# Altium project My_STM32_BOARD.PrjPcb
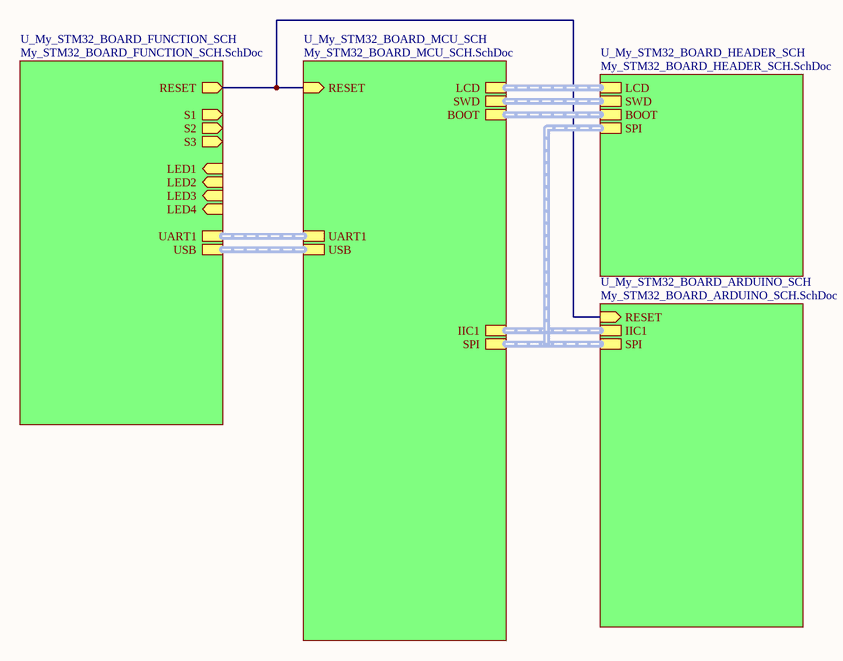
[diagram p0: My_STM32_BOARDSCH.SchDoc]
5 sheets, 69 parts. Net scope: hierarchical (ports join the sheet entries above them; power ports are global).
Board file: My_STM32_BOARD_PCB.PcbDoc
Sheets:
  My_STM32_BOARDSCH.SchDoc
    U_My_STM32_BOARD_FUNCTION_SCH = My_STM32_BOARD_FUNCTION_SCH.SchDoc
    U_My_STM32_BOARD_MCU_SCH = My_STM32_BOARD_MCU_SCH.SchDoc
    U_My_STM32_BOARD_HEADER_SCH = My_STM32_BOARD_HEADER_SCH.SchDoc
    U_My_STM32_BOARD_ARDUINO_SCH = My_STM32_BOARD_ARDUINO_SCH.SchDoc

## Sheet My_STM32_BOARDSCH.SchDoc
size A4

### Sub-sheets
U_My_STM32_BOARD_ARDUINO_SCH = My_STM32_BOARD_ARDUINO_SCH.SchDoc: IIC1 (harness IIC1), SPI (harness SPI), RESET (in)
U_My_STM32_BOARD_FUNCTION_SCH = My_STM32_BOARD_FUNCTION_SCH.SchDoc: LED1 (in), LED2 (in), LED3 (in), LED4 (in), S1 (out), S2 (out), S3 (out), RESET (out), UART1 (harness UART1), USB (harness USB)
U_My_STM32_BOARD_HEADER_SCH = My_STM32_BOARD_HEADER_SCH.SchDoc: LCD (harness FSMC), SWD (harness SWD), BOOT (harness BOOT), SPI (harness SPI)
U_My_STM32_BOARD_MCU_SCH = My_STM32_BOARD_MCU_SCH.SchDoc: RESET (in), USB (harness USB), UART1 (harness UART1), LCD (harness FSMC), SWD (harness SWD), SPI (harness SPI), IIC1 (harness IIC1), BOOT (harness BOOT)

### Nets
RESET: sheet U_My_STM32_BOARD_FUNCTION_SCH/RESET, sheet U_My_STM32_BOARD_MCU_SCH/RESET, sheet U_My_STM32_BOARD_ARDUINO_SCH/RESET

### Buses and harness runs
harness sheet U_My_STM32_BOARD_ARDUINO_SCH/IIC1 = sheet U_My_STM32_BOARD_MCU_SCH/IIC1
harness sheet U_My_STM32_BOARD_ARDUINO_SCH/SPI = sheet U_My_STM32_BOARD_HEADER_SCH/SPI = sheet U_My_STM32_BOARD_MCU_SCH/SPI
harness sheet U_My_STM32_BOARD_FUNCTION_SCH/UART1 = sheet U_My_STM32_BOARD_MCU_SCH/UART1
harness sheet U_My_STM32_BOARD_FUNCTION_SCH/USB = sheet U_My_STM32_BOARD_MCU_SCH/USB
harness sheet U_My_STM32_BOARD_HEADER_SCH/BOOT = sheet U_My_STM32_BOARD_MCU_SCH/BOOT
harness sheet U_My_STM32_BOARD_HEADER_SCH/LCD = sheet U_My_STM32_BOARD_MCU_SCH/LCD
harness sheet U_My_STM32_BOARD_HEADER_SCH/SWD = sheet U_My_STM32_BOARD_MCU_SCH/SWD

## Sheet My_STM32_BOARD_FUNCTION_SCH.SchDoc
size A4
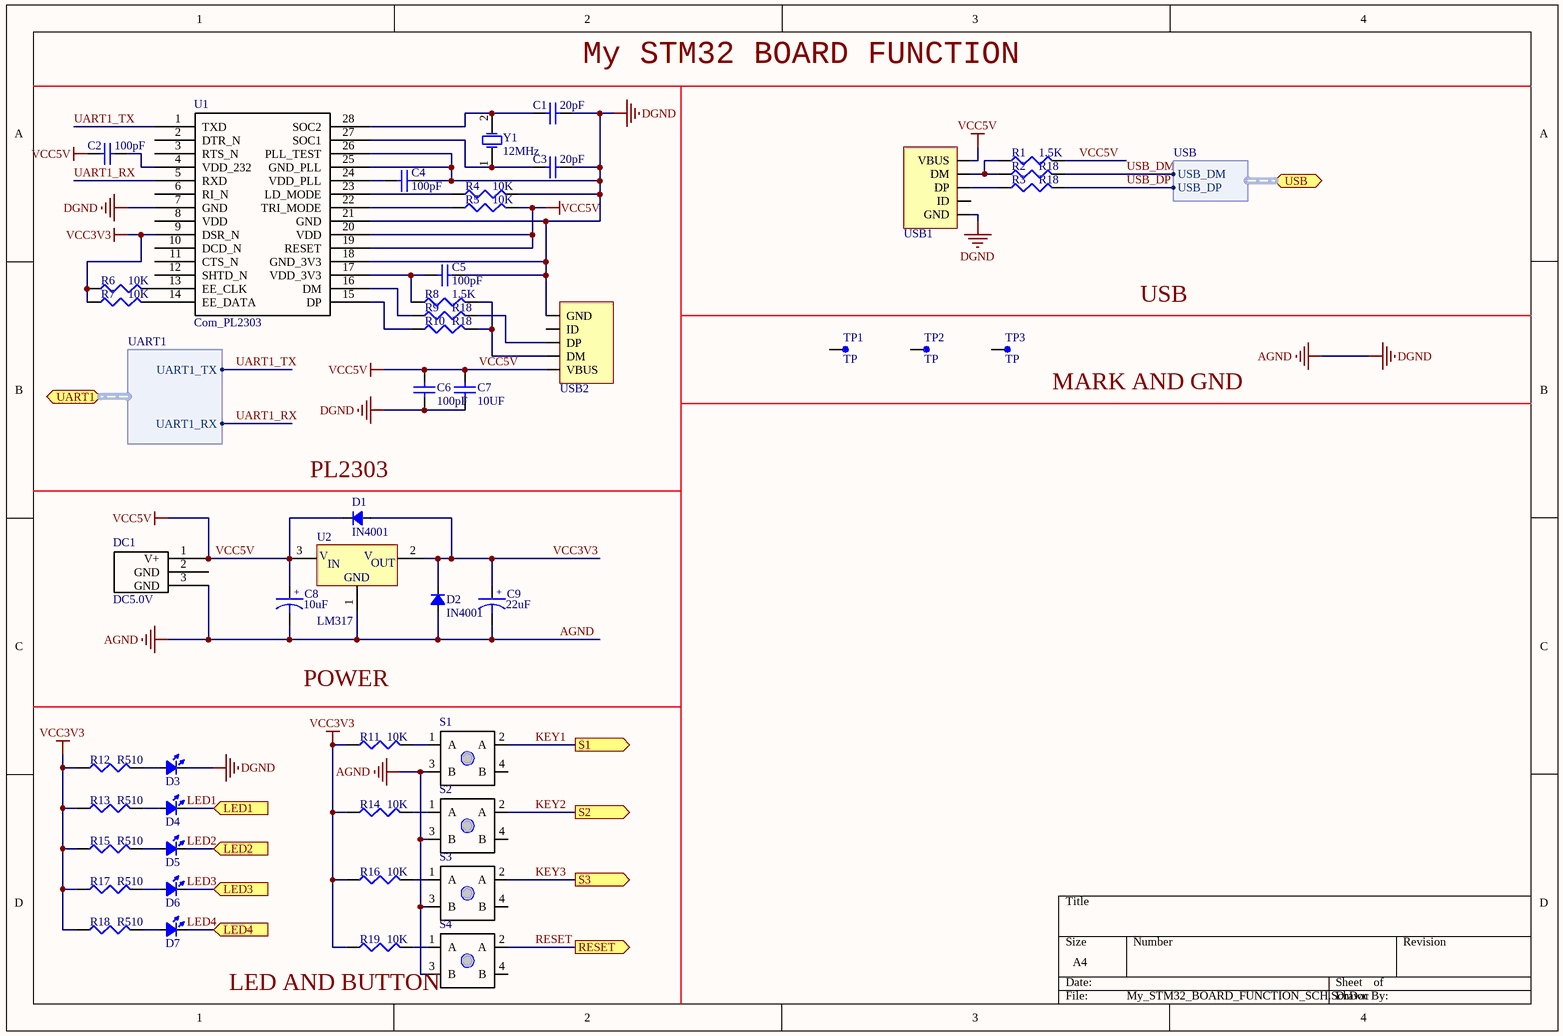
[diagram p1: My_STM32_BOARD_FUNCTION_SCH.SchDoc]

### Parts
C1  value 20pF  [0402]  (hidden comment: Cap)
C2  value 100pF  [0402]  (hidden comment: Cap)
C3  value 20pF  [0402]  (hidden comment: Cap)
C4  value 100pF  [0402]  (hidden comment: Cap)
C5  value 100pF  [0402]  (hidden comment: Cap)
C6  value 100pF  [0402]  (hidden comment: Cap)
C7  value 10UF  [2029]  (hidden comment: Cap)
C8  Cap_Pol  [Cap_Pol_F5]  (value not drawn)
C9  value 22uF  [Cap_Pol_F6]  (hidden comment: Cap_Pol)
D1  value IN4001  [DIODE_DO-214AC]
D2  value IN4001  [DIODE_DO-214AC]
D3  LED_0805  [LED_0805_RED]  (value not drawn)
D4  LED_0805  [LED_1206_BLUE]  (value not drawn)
D5  LED_0805  [LED_1206_BLUE]  (value not drawn)
D6  LED_0805  [LED_1206_BLUE]  (value not drawn)
D7  LED_0805  [LED_1206_BLUE]  (value not drawn)
DC1  DC5.0V  [DC_5V]
R1  value 1.5K  [6-0805_N]  (hidden comment: Res3)
R2  value R18  [6-0805_N]  (hidden comment: Res3)
R3  value R18  [6-0805_N]  (hidden comment: Res3)
R4  value 10K  [6-0805_N]  (hidden comment: Res3)
R5  value 10K  [6-0805_N]  (hidden comment: Res3)
R6  value 10K  [6-0805_N]  (hidden comment: Res3)
R7  value 10K  [6-0805_N]  (hidden comment: Res3)
R8  value 1.5K  [6-0805_N]  (hidden comment: Res3)
R9  value R18  [6-0805_N]  (hidden comment: Res3)
R10  value R18  [6-0805_N]  (hidden comment: Res3)
R11  value 10K  [6-0805_N]  (hidden comment: Res3)
R12  value R510  [6-0805_N]  (hidden comment: Res3)
R13  value R510  [6-0805_N]  (hidden comment: Res3)
R14  value 10K  [6-0805_N]  (hidden comment: Res3)
R15  value R510  [6-0805_N]  (hidden comment: Res3)
R16  value 10K  [6-0805_N]  (hidden comment: Res3)
R17  value R510  [6-0805_N]  (hidden comment: Res3)
R18  value R510  [6-0805_N]  (hidden comment: Res3)
R19  value 10K  [6-0805_N]  (hidden comment: Res3)
S1  Button  [My_Button]  (value not drawn)
S2  Button  [My_Button]  (value not drawn)
S3  Button  [My_Button]  (value not drawn)
S4  Button  [My_Button]  (value not drawn)
TP1  TP  [MARK]
TP2  TP  [MARK]
TP3  TP  [MARK]
U1  Com_PL2303  [SSOP-28]
U2  LM317  [lm1117]
USB1  USB_Mini  [USB_MINI-B]  (value not drawn)
USB2  USB_Mini  [USB_MINI-B]  (value not drawn)
Y1  value 12MHz  [XT_HC49S_D]  (hidden comment: XTAL)

### Ports
LED1 (in), LED2 (in), LED3 (in), LED4 (in), RESET (out), S1 (out), S2 (out), S3 (out), UART1 (harness UART1), USB (harness USB)

### Harnesses
UART1: UART1_TX, UART1_RX
USB: USB_DM, USB_DP

### Nets
AGND: C1.2 C3.2 C4.2 C5.2 C6.1 C7.1 C8.2 C9.2 D2.1(A) D3.2(K) DC1.3(GND) R4.2 S1.3(B) S2.3(B) S3.3(B) S4.3(B) U1.7(GND) U1.18(GND_3V3) U1.21(GND) U1.25(GND_PLL) U1.26(PLL_TEST) U2.1(GND) USB1.5(GND) USB2.5(GND)  [also labelled DGND]
VCC3V3: C9.1 D1.1(A) D2.2(K) R6.1 R7.1 R11.1 R12.1 R13.1 R14.1 R15.1 R16.1 R17.1 R18.1 R19.1 U1.9(DSR_N) U2.2(VOUT)
VCC5V: C2.2 C6.2 C7.2 C8.1 D1.2(K) DC1.1(V+) R1.2 R5.2 U1.19(RESET) U1.20(VDD) U2.3(VIN) USB1.1(VBUS) USB2.1(VBUS)
KEY1: S1.2(A) ; port S1
KEY2: S2.2(A) ; port S2
KEY3: S3.2(A) ; port S3
LED1: D4.2(K) ; port LED1
LED2: D5.2(K) ; port LED2
LED3: D6.2(K) ; port LED3
LED4: D7.2(K) ; port LED4
RESET: S4.2(A) ; port RESET
UART1_RX: U1.5(RXD) ; port UART1.UART1_RX
UART1_TX: U1.1(TXD) ; port UART1.UART1_TX
USB_DM: R2.2 ; port USB.USB_DM
USB_DP: R3.2 ; port USB.USB_DP
NetC1_1: C1.1 U1.28(SOC2) Y1.2
NetC2_1: C2.1 U1.4(VDD_232)
NetC3_1: C3.1 U1.27(SOC1) Y1.1
NetC4_1: C4.1 U1.24(VDD_PLL)
NetC5_1: C5.1 R8.1 U1.17(VDD_3V3)
NetD3_1: D3.1(A) R12.2
NetD4_1: D4.1(A) R13.2
NetD5_1: D5.1(A) R15.2
NetD6_1: D6.1(A) R17.2
NetD7_1: D7.1(A) R18.2
NetR1_1: R1.1 R2.1 USB1.2(DM)
NetR3_1: R3.1 USB1.3(DP)
NetR4_1: R4.1 U1.23(LD_MODE)
NetR5_1: R5.1 U1.22(TRI_MODE)
NetR6_2: R6.2 U1.13(EE_CLK)
NetR7_2: R7.2 U1.14(EE_DATA)
NetR8_2: R8.2 R10.2 USB2.2(DM)
NetR9_1: R9.1 U1.16(DM)
NetR9_2: R9.2 USB2.3(DP)
NetR10_1: R10.1 U1.15(DP)
NetR11_2: R11.2 S1.1(A)
NetR14_2: R14.2 S2.1(A)
NetR16_2: R16.2 S3.1(A)
NetR19_2: R19.2 S4.1(A)

Not connected (* = marked no-connect by the designer): DC1 2(GND); S1 4(B); S2 4(B); S3 4(B); S4 4(B); TP1 1; TP2 1; TP3 1; U1 2(DTR_N) 3(RTS_N) 6(RI_N) 8(VDD) 10(DCD_N) 11(CTS_N) 12(SHTD_N); USB1 4(ID); USB2 4(ID)

### Notes on the sheet
- (near C1) My STM32 BOARD FUNCTION
- USB
- (near TP3) MARK AND GND
- (near D1) PL2303
- POWER
- (near R19) LED AND BUTTON
- (in symbol Cap_Pol) +; 10uF
- (in symbol Power) V; IN; OUT

### Library data of the parts
C1-C7 = Cap: Capacitor; Published: 8-Jun-2000; LatestRevisionDate: 17-Jul-2002; LatestRevisionNote: Re-released for DXP Platform.; PackageReference: RAD-0.3; Publisher: Altium Limited; PackageDescription: Radial Cap, Thru-Hole; 2 Leads; 0.3 in Pin Spacing
C8 C9 = Cap_Pol: Capacitor
D1 D2 = Diode_SMA: Diode
D3-D7 = LED_0805: LED
DC1 = DC5V
R1-R19 = Res3: Resistor; Published: 8-Jun-2000; LatestRevisionDate: 29-May-2009; LatestRevisionNote: IPC-7351 Footprint Added.; PackageReference: J1-0603; Publisher: Altium Limited; PackageDescription: Chip Resistor
S1-S4 = KEY: 四脚按键
U1 = Com_PL2303: PL2303
U2 = Power: LM317 电源芯片
USB1 USB2 = USB_Mini: USB

## Sheet My_STM32_BOARD_MCU_SCH.SchDoc
size A4
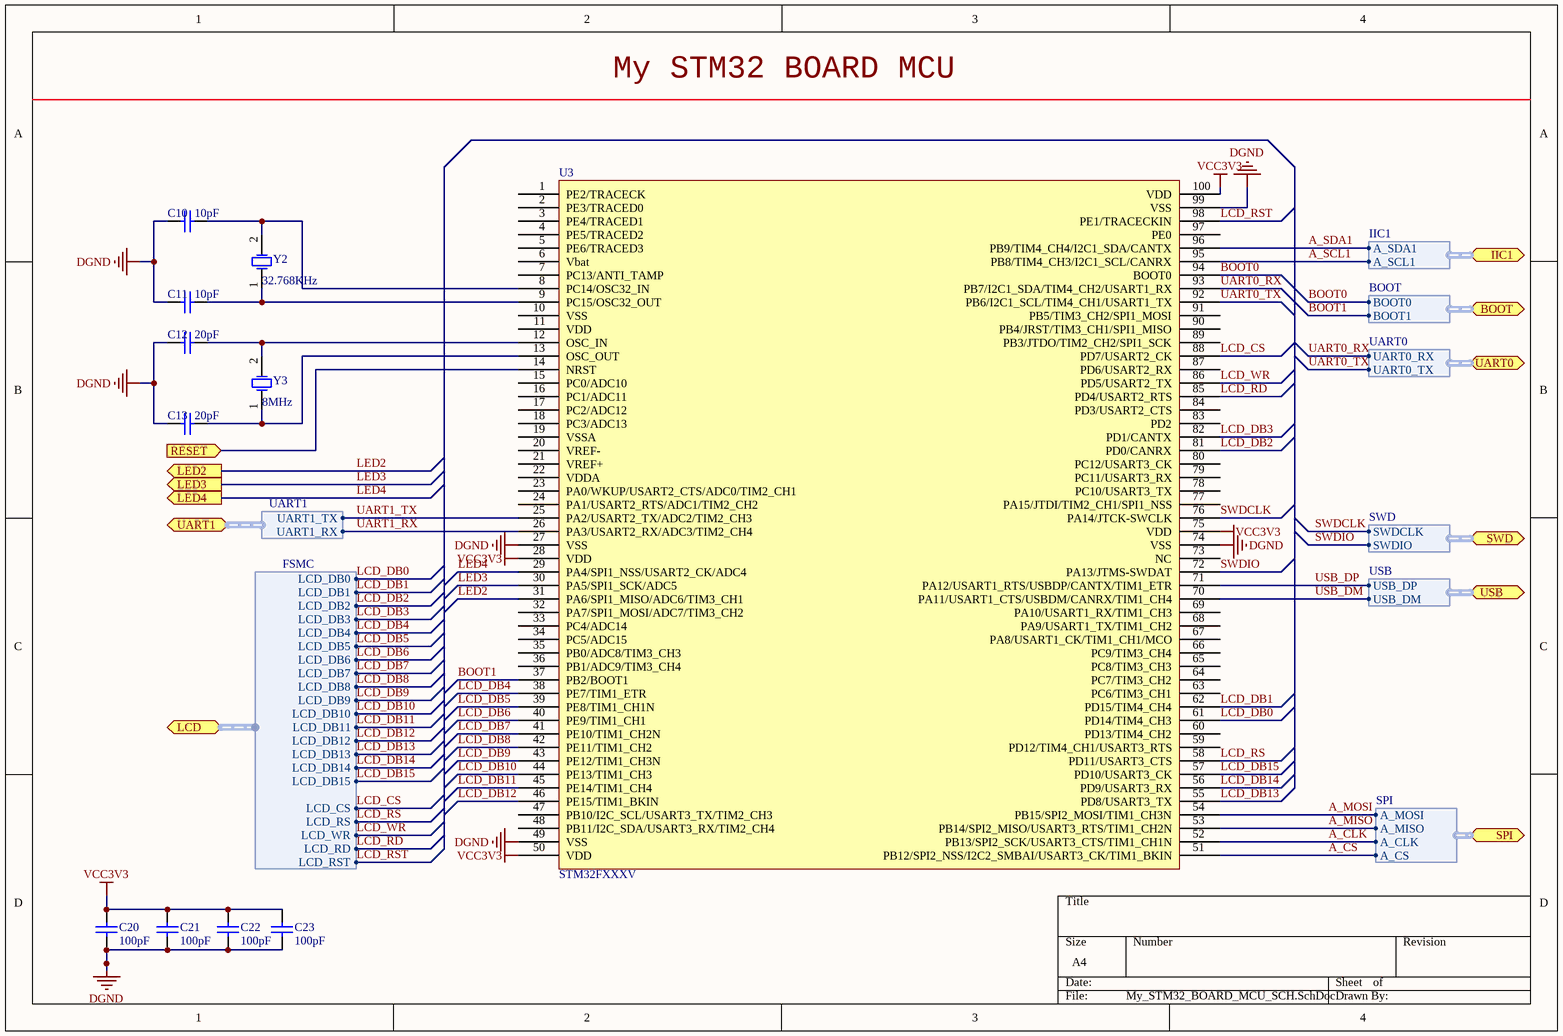
[diagram p2: My_STM32_BOARD_MCU_SCH.SchDoc]

### Parts
C10  value 10pF  [0402]  (hidden comment: Cap Semi)
C11  value 10pF  [0402]  (hidden comment: Cap Semi)
C12  value 20pF  [0402]  (hidden comment: Cap Semi)
C13  value 20pF  [0402]  (hidden comment: Cap Semi)
C20  value 100pF  [0402]  (hidden comment: Cap)
C21  value 100pF  [0402]  (hidden comment: Cap)
C22  value 100pF  [0402]  (hidden comment: Cap)
C23  value 100pF  [0402]  (hidden comment: Cap)
U3  STM32FXXXV  [LQFP-100]
Y2  value 32.768KHz  [XT_XTAL_32K]  (hidden comment: XTAL)
Y3  value 8MHz  [XT_HC49S_D]  (hidden comment: XTAL)

### Ports
BOOT (harness BOOT), IIC1 (harness IIC1), LCD (harness FSMC), LED2 (out), LED3 (out), LED4 (out), RESET (in), SPI (harness SPI), SWD (harness SWD), UART0 (harness UART0), UART1 (harness UART1), USB (harness USB)

### Harnesses
USB: USB_DP, USB_DM
UART1: UART1_TX, UART1_RX
FSMC: LCD_RST, LCD_RD, LCD_WR, LCD_RS, LCD_CS, LCD_DB0, LCD_DB1, LCD_DB2, LCD_DB3, LCD_DB4, LCD_DB5, LCD_DB6, LCD_DB7, LCD_DB8, LCD_DB9, LCD_DB10, LCD_DB11, LCD_DB12, LCD_DB13, LCD_DB14, LCD_DB15
SWD: SWDIO, SWDCLK
SPI: A_CLK, A_MISO, A_MOSI, A_CS
IIC1: A_SCL1, A_SDA1
BOOT: BOOT1, BOOT0
UART0: UART0_TX, UART0_RX

### Nets
DGND: C10.1 C11.1 C12.1 C13.1 C20.1 C21.1 C22.1 C23.1 U3.27(VSS) U3.49(VSS) U3.74(VSS) U3.99(VSS)  [project net AGND]
VCC3V3: C20.2 C21.2 C22.2 C23.2 U3.28(VDD) U3.50(VDD) U3.75(VDD) U3.100(VDD)
A_CLK: U3.52(PB13/SPI2_SCK/USART3_CTS/TIM1_CH1N) ; port SPI.A_CLK
A_CS: U3.51(PB12/SPI2_NSS/I2C2_SMBAI/USART3_CK/TIM1_BKIN) ; port SPI.A_CS
A_MISO: U3.53(PB14/SPI2_MISO/USART3_RTS/TIM1_CH2N) ; port SPI.A_MISO
A_MOSI: U3.54(PB15/SPI2_MOSI/TIM1_CH3N) ; port SPI.A_MOSI
A_SCL1: U3.95(PB8/TIM4_CH3/I2C1_SCL/CANRX) ; port IIC1.A_SCL1
A_SDA1: U3.96(PB9/TIM4_CH4/I2C1_SDA/CANTX) ; port IIC1.A_SDA1
BOOT0: U3.94(BOOT0) ; port BOOT.BOOT0
BOOT1: U3.37(PB2/BOOT1) ; port BOOT.BOOT1
LCD_CS: U3.88(PD7/USART2_CK) ; port LCD.LCD_CS
LCD_DB0: U3.61(PD14/TIM4_CH3) ; port LCD.LCD_DB0
LCD_DB1: U3.62(PD15/TIM4_CH4) ; port LCD.LCD_DB1
LCD_DB2: U3.81(PD0/CANRX) ; port LCD.LCD_DB2
LCD_DB3: U3.82(PD1/CANTX) ; port LCD.LCD_DB3
LCD_DB4: U3.38(PE7/TIM1_ETR) ; port LCD.LCD_DB4
LCD_DB5: U3.39(PE8/TIM1_CH1N) ; port LCD.LCD_DB5
LCD_DB6: U3.40(PE9/TIM1_CH1) ; port LCD.LCD_DB6
LCD_DB7: U3.41(PE10/TIM1_CH2N) ; port LCD.LCD_DB7
LCD_DB8: U3.42(PE11/TIM1_CH2) ; port LCD.LCD_DB8
LCD_DB9: U3.43(PE12/TIM1_CH3N) ; port LCD.LCD_DB9
LCD_DB10: U3.44(PE13/TIM1_CH3) ; port LCD.LCD_DB10
LCD_DB11: U3.45(PE14/TIM1_CH4) ; port LCD.LCD_DB11
LCD_DB12: U3.46(PE15/TIM1_BKIN) ; port LCD.LCD_DB12
LCD_DB13: U3.55(PD8/USART3_TX) ; port LCD.LCD_DB13
LCD_DB14: U3.56(PD9/USART3_RX) ; port LCD.LCD_DB14
LCD_DB15: U3.57(PD10/USART3_CK) ; port LCD.LCD_DB15
LCD_RD: U3.85(PD4/USART2_RTS) ; port LCD.LCD_RD
LCD_RS: U3.58(PD11/USART3_CTS) ; port LCD.LCD_RS
LCD_RST: U3.98(PE1/TRACECKIN) ; port LCD.LCD_RST
LCD_WR: U3.86(PD5/USART2_TX) ; port LCD.LCD_WR
LED2: U3.31(PA6/SPI1_MISO/ADC6/TIM3_CH1) ; port LED2
LED3: U3.30(PA5/SPI1_SCK/ADC5) ; port LED3
LED4: U3.29(PA4/SPI1_NSS/USART2_CK/ADC4) ; port LED4
RESET: U3.14(NRST) ; port RESET
SWDCLK: U3.76(PA14/JTCK-SWCLK) ; port SWD.SWDCLK
SWDIO: U3.72(PA13/JTMS-SWDAT) ; port SWD.SWDIO
UART0_RX: U3.93(PB7/I2C1_SDA/TIM4_CH2/USART1_RX) ; port UART0.UART0_RX
UART0_TX: U3.92(PB6/I2C1_SCL/TIM4_CH1/USART1_TX) ; port UART0.UART0_TX
UART1_RX: U3.26(PA3/USART2_RX/ADC3/TIM2_CH4) ; port UART1.UART1_RX
UART1_TX: U3.25(PA2/USART2_TX/ADC2/TIM2_CH3) ; port UART1.UART1_TX
USB_DM: U3.70(PA11/USART1_CTS/USBDM/CANRX/TIM1_CH4) ; port USB.USB_DM
USB_DP: U3.71(PA12/USART1_RTS/USBDP/CANTX/TIM1_ETR) ; port USB.USB_DP
NetC10_2: C10.2 U3.8(PC14/OSC32_IN) Y2.2
NetC11_2: C11.2 U3.9(PC15/OSC32_OUT) Y2.1
NetC12_2: C12.2 U3.12(OSC_IN) Y3.2
NetC13_2: C13.2 U3.13(OSC_OUT) Y3.1

Not connected (* = marked no-connect by the designer): U3 1(PE2/TRACECK) 2(PE3/TRACED0) 3(PE4/TRACED1) 4(PE5/TRACED2) 5(PE6/TRACED3) 6(Vbat) 7(PC13/ANTI_TAMP) 10(VSS) 11(VDD) 15(PC0/ADC10) 16(PC1/ADC11) 17(PC2/ADC12) 18(PC3/ADC13) 19(VSSA) 20(VREF-) 21(VREF+) 22(VDDA) 23(PA0/WKUP/USART2_CTS/ADC0/TIM2_CH1) 24(PA1/USART2_RTS/ADC1/TIM2_CH2) 32(PA7/SPI1_MOSI/ADC7/TIM3_CH2) 33(PC4/ADC14) 34(PC5/ADC15) 35(PB0/ADC8/TIM3_CH3) 36(PB1/ADC9/TIM3_CH4) 47(PB10/I2C_SCL/USART3_TX/TIM2_CH3) 48(PB11/I2C_SDA/USART3_RX/TIM2_CH4) 59(PD12/TIM4_CH1/USART3_RTS) 60(PD13/TIM4_CH2) 63(PC6/TIM3_CH1) 64(PC7/TIM3_CH2) 65(PC8/TIM3_CH3) 66(PC9/TIM3_CH4) 67(PA8/USART1_CK/TIM1_CH1/MCO) 68(PA9/USART1_TX/TIM1_CH2) 69(PA10/USART1_RX/TIM1_CH3) 73(NC) 77(PA15/JTDI/TIM2_CH1/SPI1_NSS) 78(PC10/USART3_TX) 79(PC11/USART3_RX) 80(PC12/USART3_CK) 83(PD2) 84(PD3/USART2_CTS) 87(PD6/USART2_RX) 89(PB3/JTDO/TIM2_CH2/SPI1_SCK) 90(PB4/JRST/TIM3_CH1/SPI1_MISO) 91(PB5/TIM3_CH2/SPI1_MOSI) 97(PE0)

### Notes on the sheet
- My STM32 BOARD MCU

### Library data of the parts
C10-C13 = Cap Semi: Capacitor (Semiconductor SIM Model); Published: 8-Jun-2000; LatestRevisionDate: 29-May-2009; LatestRevisionNote: IPC-7351 Footprint Added.; PackageReference: C1206; Publisher: Altium Limited; PackageDescription: Chip Capacitor
C20-C23 = Cap: Capacitor; Published: 8-Jun-2000; LatestRevisionDate: 17-Jul-2002; LatestRevisionNote: Re-released for DXP Platform.; PackageReference: RAD-0.3; Publisher: Altium Limited; PackageDescription: Radial Cap, Thru-Hole; 2 Leads; 0.3 in Pin Spacing

## Sheet My_STM32_BOARD_HEADER_SCH.SchDoc
size A4
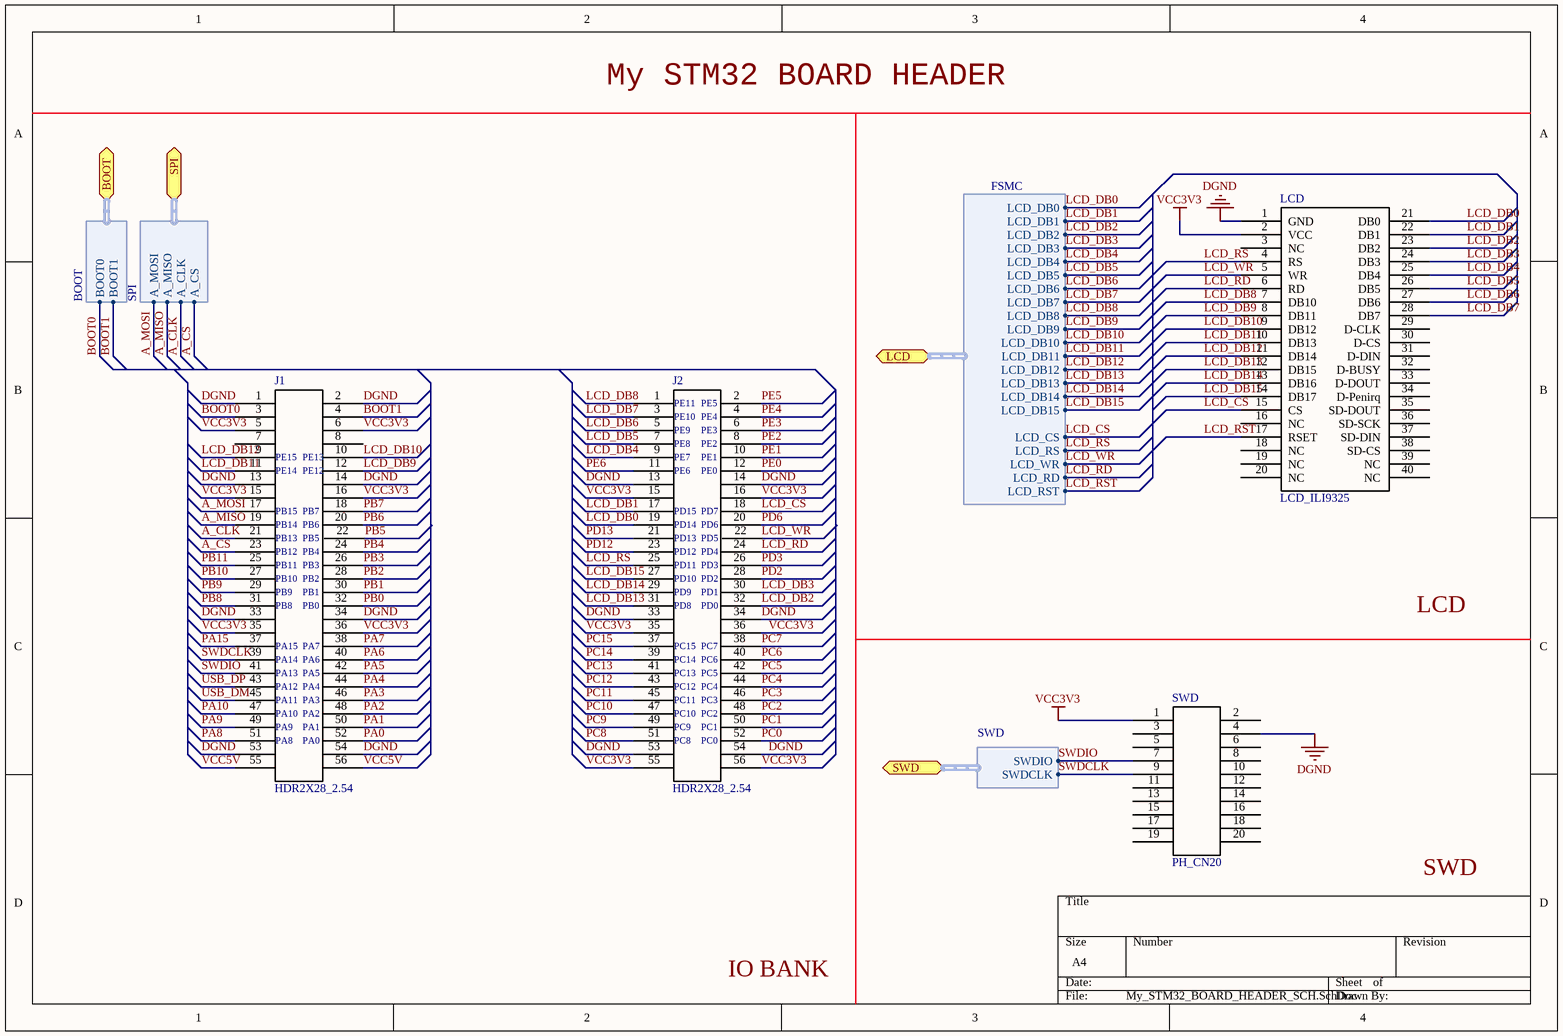
[diagram p3: My_STM32_BOARD_HEADER_SCH.SchDoc]

### Parts
J1  HDR2X28_2.54  [HDR2X28_2.54]
J2  HDR2X28_2.54  [HDR2X28_2.54]
LCD  LCD_ILI9325  [ILI9325]
SWD  PH_CN20  [CN20]

### Ports
BOOT (harness BOOT), LCD (harness FSMC), SPI (harness SPI), SWD (harness SWD)

### Harnesses
FSMC: LCD_RST, LCD_RD, LCD_WR, LCD_RS, LCD_CS, LCD_DB0, LCD_DB1, LCD_DB2, LCD_DB3, LCD_DB4, LCD_DB5, LCD_DB6, LCD_DB7, LCD_DB8, LCD_DB9, LCD_DB10, LCD_DB11, LCD_DB12, LCD_DB13, LCD_DB14, LCD_DB15
SWD: SWDIO, SWDCLK
BOOT: BOOT1, BOOT0
SPI: A_CLK, A_MISO, A_MOSI, A_CS

### Nets
DGND: J1.1 J1.2 J1.13 J1.14 J1.33 J1.34 J1.53 J1.54 J2.13 J2.14 J2.33 J2.34 J2.53 J2.54 LCD.1(GND) SWD.4  [project net AGND]
VCC3V3: J1.5 J1.6 J1.15 J1.16 J1.35 J1.36 J2.15 J2.16 J2.35 J2.36 J2.55 J2.56 LCD.2(VCC) SWD.1
A_CLK: J1.21 ; port SPI.A_CLK
A_CS: J1.23 ; port SPI.A_CS
A_MISO: J1.19 ; port SPI.A_MISO
A_MOSI: J1.17 ; port SPI.A_MOSI
BOOT0: J1.3 ; port BOOT.BOOT0
BOOT1: J1.4 ; port BOOT.BOOT1
LCD_CS: J2.18 LCD.15(CS) ; port LCD.LCD_CS
LCD_DB0: J2.19 LCD.21(DB0) ; port LCD.LCD_DB0
LCD_DB1: J2.17 LCD.22(DB1) ; port LCD.LCD_DB1
LCD_DB2: J2.32 LCD.23(DB2) ; port LCD.LCD_DB2
LCD_DB3: J2.30 LCD.24(DB3) ; port LCD.LCD_DB3
LCD_DB4: J2.9 LCD.25(DB4) ; port LCD.LCD_DB4
LCD_DB5: J2.7 LCD.26(DB5) ; port LCD.LCD_DB5
LCD_DB6: J2.5 LCD.27(DB6) ; port LCD.LCD_DB6
LCD_DB7: J2.3 LCD.28(DB7) ; port LCD.LCD_DB7
LCD_DB8: J2.1 LCD.7(DB10) ; port LCD.LCD_DB8
LCD_DB9: J1.12 LCD.8(DB11) ; port LCD.LCD_DB9
LCD_DB10: J1.10 LCD.9(DB12) ; port LCD.LCD_DB10
LCD_DB11: J1.11 LCD.10(DB13) ; port LCD.LCD_DB11
LCD_DB12: J1.9 LCD.11(DB14) ; port LCD.LCD_DB12
LCD_DB13: J2.31 LCD.12(DB15) ; port LCD.LCD_DB13
LCD_DB14: J2.29 LCD.13(DB16) ; port LCD.LCD_DB14
LCD_DB15: J2.27 LCD.14(DB17) ; port LCD.LCD_DB15
LCD_RD: J2.24 LCD.6(RD) ; port LCD.LCD_RD
LCD_RS: J2.25 LCD.4(RS) ; port LCD.LCD_RS
LCD_RST: LCD.17(RSET) ; port LCD.LCD_RST
LCD_WR: LCD.5(WR) ; port LCD.LCD_WR
PA0: J1.52
PA1: J1.50
PA2: J1.48
PA3: J1.46
PA4: J1.44
PA5: J1.42
PA6: J1.40
PA7: J1.38
PA8: J1.51
PA9: J1.49
PA10: J1.47
PA15: J1.37
PB0: J1.32
PB1: J1.30
PB2: J1.28
PB3: J1.26
PB4: J1.24
PB5: J1.22
PB6: J1.20
PB7: J1.18
PB8: J1.31
PB9: J1.29
PB10: J1.27
PB11: J1.25
PC0: J2.52
PC1: J2.50
PC2: J2.48
PC3: J2.46
PC4: J2.44
PC5: J2.42
PC6: J2.40
PC7: J2.38
PC8: J2.51
PC9: J2.49
PC10: J2.47
PC11: J2.45
PC12: J2.43
PC13: J2.41
PC14: J2.39
PC15: J2.37
PD2: J2.28
PD3: J2.26
PD6: J2.20
PD12: J2.23
PD13: J2.21
PE0: J2.12
PE1: J2.10
PE2: J2.8
PE3: J2.6
PE4: J2.4
PE5: J2.2
PE6: J2.11
SWDCLK: J1.39 SWD.9 ; port SWD.SWDCLK
SWDIO: J1.41 SWD.7 ; port SWD.SWDIO
USB_DM: J1.45
USB_DP: J1.43
VCC5V: J1.55 J1.56

Not connected (* = marked no-connect by the designer): J1 7 8; J2 22; LCD 3(NC) 16(NC) 18(NC) 19(NC) 20(NC) 29(D-CLK) 30(D-CS) 31(D-DIN) 32(D-BUSY) 33(D-DOUT) 34(D-Penirq) 35(SD-DOUT) 36(SD-SCK) 37(SD-DIN) 38(SD-CS) 39(NC) 40(NC); SWD 2 3 5 6 8 10 11 12 13 14 15 16 17 18 19 20

### Notes on the sheet
- My STM32 BOARD HEADER
- (near J2) PE8
- (near J2) PE9
- (near J2) PE10
- (near J2) PE11
- (near J2) PE2
- (near J2) PE3
- (near J2) PE4
- (near J2) PE5
- (near J1) PB15
- (near J1) PE14
- (near J1) PE15
- (near J1) PB7
- (near J1) PE12
- (near J1) PE13
- (near J2) PD15
- (near J2) PE6
- (near J2) PE7
- (near J2) PD7
- (near J2) PE0
- (near J2) PE1
- (near J1) PB10
- (near J1) PB11
- (near J1) PB12
- (near J1) PB13
- (near J1) PB14
- (near J1) PB2
- (near J1) PB3
- (near J1) PB4
- (near J1) PB5
- (near J1) PB6
- (near J2) PD10
- (near J2) PD11
- (near J2) PD12
- (near J2) PD13
- (near J2) PD14
- (near J2) PD2
- (near J2) PD3
- (near J2) PD4
- (near J2) PD5
- (near J2) PD6
- (near J1) PA15
- (near J1) PB8
- (near J1) PB9
- (near J1) PA7
- (near J1) PB0
- (near J1) PB1
- (near J2) PC15
- (near J2) PD8
- (near J2) PD9
- (near J2) PC7
- (near J2) PD0
- (near J2) PD1
- LCD
- (near J1) PA11
- (near J1) PA12
- (near J1) PA10
- (near J1) PA13
- (near J1) PA14
- (near J1) PA2
- (near J1) PA3
- (near J1) PA4
- (near J1) PA5
- (near J1) PA6
- (near J2) PC10
- (near J2) PC11
- (near J2) PC12
- (near J2) PC13
- (near J2) PC14
- (near J2) PC2
- (near J2) PC3
- (near J2) PC4
- (near J2) PC5
- (near J2) PC6
- (near J1) PA8
- (near J1) PA9
- (near J1) PA0
- (near J1) PA1
- (near J2) PC8
- (near J2) PC9
- (near J2) PC0
- (near J2) PC1
- SWD
- IO BANK
- Labels drawn without touching a wire or pin: LCD_WR

### Library data of the parts
LCD = LCD_ILI9325: LCD ILI9325
SWD = PH_CN20: 10 X 2

## Sheet My_STM32_BOARD_ARDUINO_SCH.SchDoc
size A4
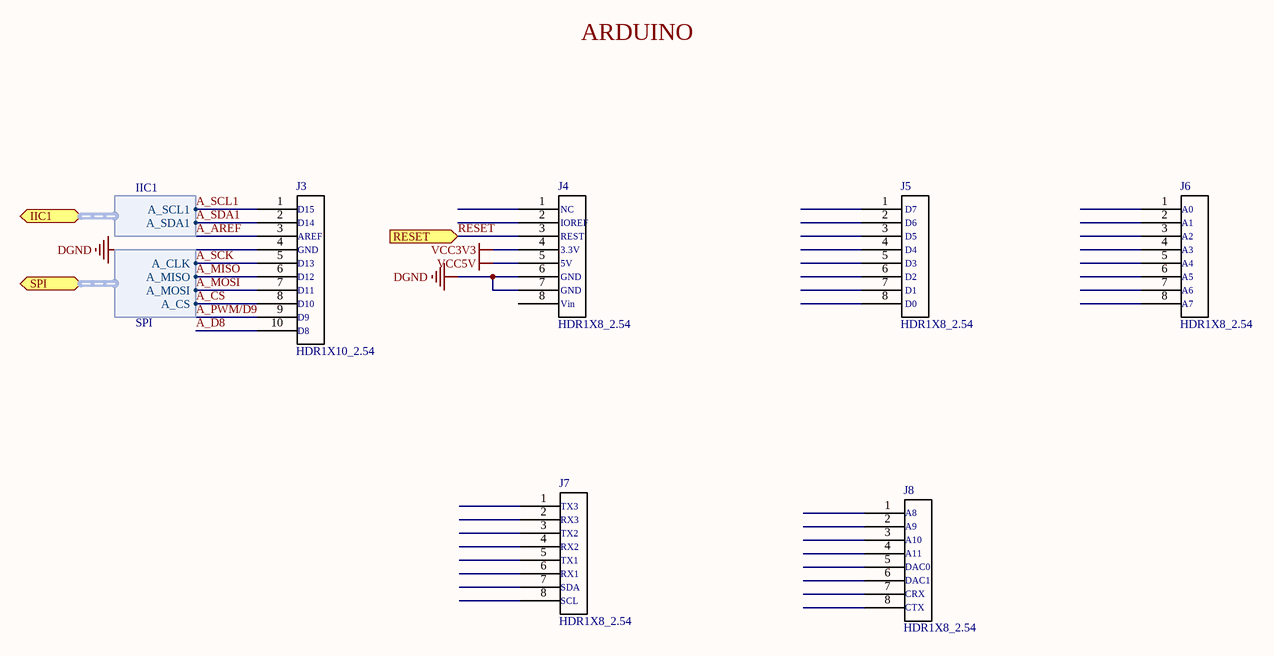
[diagram p4: My_STM32_BOARD_ARDUINO_SCH.SchDoc]

### Parts
J3  HDR1X10_2.54  [HDR1X10_2.54_180]
J4  HDR1X8_2.54  [HDR1X8_2.54_180]
J5  HDR1X8_2.54  [HDR1X8_2.54_180]
J6  HDR1X8_2.54  [HDR1X8_2.54_180]
J7  HDR1X8_2.54  [HDR1X8_2.54_180]
J8  HDR1X8_2.54  [HDR1X8_2.54_180]

### Ports
IIC1 (harness IIC1), RESET (in), SPI (harness SPI)

### Harnesses
IIC1: A_SCL1, A_SDA1
SPI: A_CLK, A_MISO, A_MOSI, A_CS

### Nets
DGND: J3.4 J4.6 J4.7  [project net AGND]
VCC3V3: J4.4
VCC5V: J4.5
A_AREF: J3.3
A_CS: J3.8 ; port SPI.A_CS
A_D8: J3.10
A_MISO: J3.6 ; port SPI.A_MISO
A_MOSI: J3.7 ; port SPI.A_MOSI
A_PWM/D9: J3.9
A_SCK: J3.5 ; port SPI.A_CLK  [project net A_CLK]
A_SCL1: J3.1 ; port IIC1.A_SCL1
A_SDA1: J3.2 ; port IIC1.A_SDA1
RESET: J4.3 ; port RESET

Not connected (* = marked no-connect by the designer): J4 1 2 8; J5 1 2 3 4 5 6 7 8; J6 1 2 3 4 5 6 7 8; J7 1 2 3 4 5 6 7 8; J8 1 2 3 4 5 6 7 8

### Notes on the sheet
- ARDUINO
- (near J3) D15
- (near J3) D14
- (near J3) AREF
- (near J3) GND
- (near J4) 3.3V
- (near J4) REST
- (near J4) IOREF
- (near J4) NC
- (near J5) D4
- (near J5) D5
- (near J5) D6
- (near J5) D7
- (near J6) A0
- (near J6) A1
- (near J6) A2
- (near J6) A3
- (near J3) D8
- (near J3) D9
- (near J3) D10
- (near J3) D11
- (near J3) D12
- (near J3) D13
- (near J4) Vin
- (near J4) GND
- (near J4) 5V
- (near J5) D0
- (near J5) D1
- (near J5) D2
- (near J5) D3
- (near J6) A4
- (near J6) A5
- (near J6) A6
- (near J6) A7
- (near J7) TX3
- (near J7) RX3
- (near J8) A8
- (near J8) A9
- (near J7) TX1
- (near J7) TX2
- (near J7) RX1
- (near J7) RX2
- (near J7) SCL
- (near J7) SDA
- (near J8) A10
- (near J8) A11
- (near J8) DAC0
- (near J8) DAC1
- (near J8) CRX
- (near J8) CTX

## Nets that join several sheets
AGND: My_STM32_BOARD_FUNCTION_SCH (24 pins), My_STM32_BOARD_MCU_SCH (12 pins), My_STM32_BOARD_HEADER_SCH (16 pins), My_STM32_BOARD_ARDUINO_SCH (J3.4 J4.6 J4.7)
VCC3V3: My_STM32_BOARD_FUNCTION_SCH (16 pins), My_STM32_BOARD_MCU_SCH (8 pins), My_STM32_BOARD_HEADER_SCH (14 pins), My_STM32_BOARD_ARDUINO_SCH (J4.4)
VCC5V: My_STM32_BOARD_FUNCTION_SCH (13 pins), My_STM32_BOARD_ARDUINO_SCH (J4.5)
A_CLK: My_STM32_BOARD_MCU_SCH (U3.52), My_STM32_BOARD_HEADER_SCH (J1.21), My_STM32_BOARD_ARDUINO_SCH (J3.5)
A_CS: My_STM32_BOARD_MCU_SCH (U3.51), My_STM32_BOARD_HEADER_SCH (J1.23), My_STM32_BOARD_ARDUINO_SCH (J3.8)
A_MISO: My_STM32_BOARD_MCU_SCH (U3.53), My_STM32_BOARD_HEADER_SCH (J1.19), My_STM32_BOARD_ARDUINO_SCH (J3.6)
A_MOSI: My_STM32_BOARD_MCU_SCH (U3.54), My_STM32_BOARD_HEADER_SCH (J1.17), My_STM32_BOARD_ARDUINO_SCH (J3.7)
A_SCL1: My_STM32_BOARD_MCU_SCH (U3.95), My_STM32_BOARD_ARDUINO_SCH (J3.1)
A_SDA1: My_STM32_BOARD_MCU_SCH (U3.96), My_STM32_BOARD_ARDUINO_SCH (J3.2)
BOOT0: My_STM32_BOARD_MCU_SCH (U3.94), My_STM32_BOARD_HEADER_SCH (J1.3)
BOOT1: My_STM32_BOARD_MCU_SCH (U3.37), My_STM32_BOARD_HEADER_SCH (J1.4)
LCD_CS: My_STM32_BOARD_MCU_SCH (U3.88), My_STM32_BOARD_HEADER_SCH (J2.18 LCD.15)
LCD_DB0: My_STM32_BOARD_MCU_SCH (U3.61), My_STM32_BOARD_HEADER_SCH (J2.19 LCD.21)
LCD_DB1: My_STM32_BOARD_MCU_SCH (U3.62), My_STM32_BOARD_HEADER_SCH (J2.17 LCD.22)
LCD_DB2: My_STM32_BOARD_MCU_SCH (U3.81), My_STM32_BOARD_HEADER_SCH (J2.32 LCD.23)
LCD_DB3: My_STM32_BOARD_MCU_SCH (U3.82), My_STM32_BOARD_HEADER_SCH (J2.30 LCD.24)
LCD_DB4: My_STM32_BOARD_MCU_SCH (U3.38), My_STM32_BOARD_HEADER_SCH (J2.9 LCD.25)
LCD_DB5: My_STM32_BOARD_MCU_SCH (U3.39), My_STM32_BOARD_HEADER_SCH (J2.7 LCD.26)
LCD_DB6: My_STM32_BOARD_MCU_SCH (U3.40), My_STM32_BOARD_HEADER_SCH (J2.5 LCD.27)
LCD_DB7: My_STM32_BOARD_MCU_SCH (U3.41), My_STM32_BOARD_HEADER_SCH (J2.3 LCD.28)
LCD_DB8: My_STM32_BOARD_MCU_SCH (U3.42), My_STM32_BOARD_HEADER_SCH (J2.1 LCD.7)
LCD_DB9: My_STM32_BOARD_MCU_SCH (U3.43), My_STM32_BOARD_HEADER_SCH (J1.12 LCD.8)
LCD_DB10: My_STM32_BOARD_MCU_SCH (U3.44), My_STM32_BOARD_HEADER_SCH (J1.10 LCD.9)
LCD_DB11: My_STM32_BOARD_MCU_SCH (U3.45), My_STM32_BOARD_HEADER_SCH (J1.11 LCD.10)
LCD_DB12: My_STM32_BOARD_MCU_SCH (U3.46), My_STM32_BOARD_HEADER_SCH (J1.9 LCD.11)
LCD_DB13: My_STM32_BOARD_MCU_SCH (U3.55), My_STM32_BOARD_HEADER_SCH (J2.31 LCD.12)
LCD_DB14: My_STM32_BOARD_MCU_SCH (U3.56), My_STM32_BOARD_HEADER_SCH (J2.29 LCD.13)
LCD_DB15: My_STM32_BOARD_MCU_SCH (U3.57), My_STM32_BOARD_HEADER_SCH (J2.27 LCD.14)
LCD_RD: My_STM32_BOARD_MCU_SCH (U3.85), My_STM32_BOARD_HEADER_SCH (J2.24 LCD.6)
LCD_RS: My_STM32_BOARD_MCU_SCH (U3.58), My_STM32_BOARD_HEADER_SCH (J2.25 LCD.4)
LCD_RST: My_STM32_BOARD_MCU_SCH (U3.98), My_STM32_BOARD_HEADER_SCH (LCD.17)
LCD_WR: My_STM32_BOARD_MCU_SCH (U3.86), My_STM32_BOARD_HEADER_SCH (LCD.5)
RESET: My_STM32_BOARD_FUNCTION_SCH (S4.2), My_STM32_BOARD_MCU_SCH (U3.14), My_STM32_BOARD_ARDUINO_SCH (J4.3)
SWDCLK: My_STM32_BOARD_MCU_SCH (U3.76), My_STM32_BOARD_HEADER_SCH (J1.39 SWD.9)
SWDIO: My_STM32_BOARD_MCU_SCH (U3.72), My_STM32_BOARD_HEADER_SCH (J1.41 SWD.7)
UART1_RX: My_STM32_BOARD_FUNCTION_SCH (U1.5), My_STM32_BOARD_MCU_SCH (U3.26)
UART1_TX: My_STM32_BOARD_FUNCTION_SCH (U1.1), My_STM32_BOARD_MCU_SCH (U3.25)
USB_DM: My_STM32_BOARD_FUNCTION_SCH (R2.2), My_STM32_BOARD_MCU_SCH (U3.70)
USB_DP: My_STM32_BOARD_FUNCTION_SCH (R3.2), My_STM32_BOARD_MCU_SCH (U3.71)